# Altium schematic sheet Artix7_Power_1.SchDoc
size A3; SheetNumber: 4; SheetTotal: 14
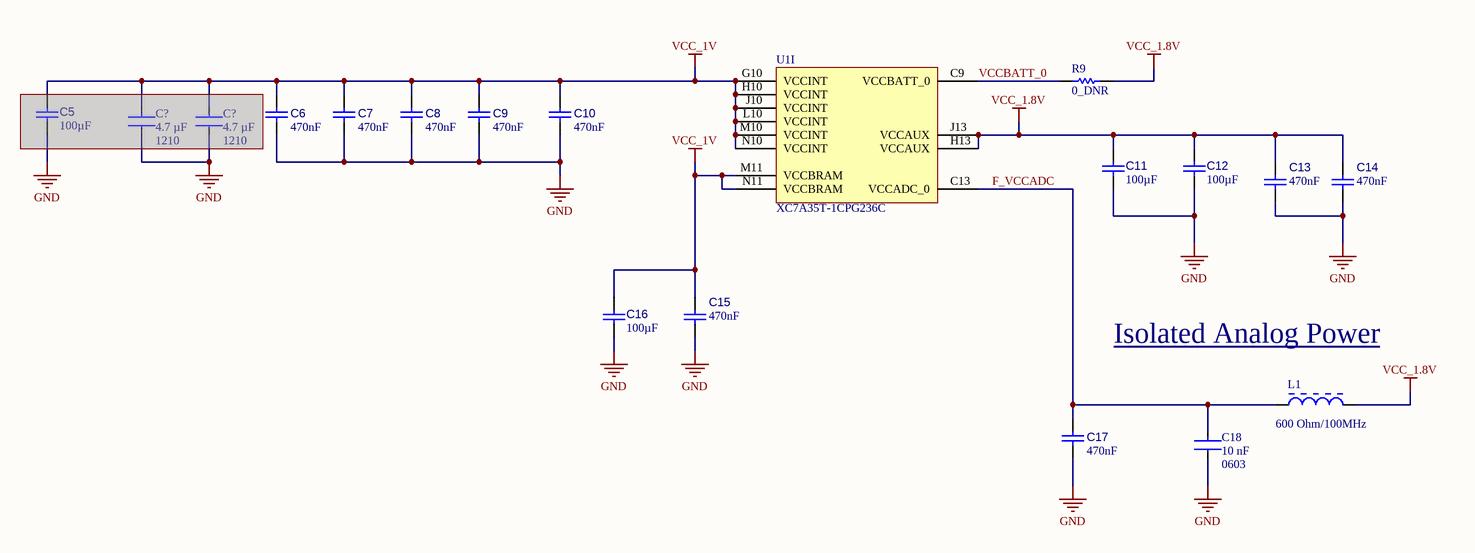
[diagram p0: Artix7_Power_1.SchDoc]

## Parts
(Parts that share a designator on the sheet are numbered #1, #2 ... from top to bottom, then left to right.)
C5  value 100µF  [CAPC0805(2012)145_L]  (hidden comment: Capacitor 100µF +/-20% 6.3V 0805)  (masked out: inside a compile mask, not in the netlist)
C6  value 470nF  [CAPC0402(1005)60_L]  (hidden comment: Capacitor 470nF +/-40% 10V 0402)
C7  value 470nF  [CAPC0402(1005)60_L]  (hidden comment: Capacitor 470nF +/-40% 10V 0402)
C8  value 470nF  [CAPC0402(1005)60_L]  (hidden comment: Capacitor 470nF +/-40% 10V 0402)
C9  value 470nF  [CAPC0402(1005)60_L]  (hidden comment: Capacitor 470nF +/-40% 10V 0402)
C10  value 470nF  [CAPC0402(1005)60_L]  (hidden comment: Capacitor 470nF +/-40% 10V 0402)
C11  value 100µF  [CAPC0805(2012)145_L]  (hidden comment: Capacitor 100µF +/-20% 6.3V 0805)
C12  value 100µF  [CAPC0805(2012)145_L]  (hidden comment: Capacitor 100µF +/-20% 6.3V 0805)
C13  value 470nF  [CAPC0402(1005)60_L]  (hidden comment: Capacitor 470nF +/-40% 10V 0402)
C14  value 470nF  [CAPC0402(1005)60_L]  (hidden comment: Capacitor 470nF +/-40% 10V 0402)
C15  value 470nF  [CAPC0402(1005)60_L]  (hidden comment: Capacitor 470nF +/-40% 10V 0402)
C16  value 100µF  [CAPC0805(2012)145_L]  (hidden comment: Capacitor 100µF +/-20% 6.3V 0805)
C17  value 470nF  [CAPC0402(1005)60_L]  (hidden comment: Capacitor 470nF +/-40% 10V 0402)
C18  Case Code (Imperial): 0603  Capacitance: 10 nF  [FP-0603-L_1_6_0_1-W_0_8_0-MFG]  (hidden comment: EMK107SD103KA-T)
C?#1  Case/Package: 1210  Capacitance: 4.7 µF  [FP-1210-L_3_3_0_4-W_2_5_0-IPC_B]  (hidden comment: 12105C475K4Z2A)  (masked out: inside a compile mask, not in the netlist)
C?#2  Case/Package: 1210  Capacitance: 4.7 µF  [FP-1210-L_3_3_0_4-W_2_5_0-IPC_B]  (hidden comment: 12105C475K4Z2A)  (masked out: inside a compile mask, not in the netlist)
L1  OhmAtFreq: 600 Ohm/100MHz  [BOUR-SRN3015-2_V]  (hidden comment: SRN3015-3R3M)
R9  value 0_DNR  [RESC0402(1005)_L]  (hidden comment: Resistor 10R  +/-1 % 0402 63 mW)
U1  XC7A35T-1CPG236C  [CPG236]  (part I of 10)

## Nets
GND: C6.2 C7.2 C8.2 C9.2 C10.2 C11.2 C12.2 C13.2 C14.1 C15.1 C16.2 C17.1 C18.2
VCC_1.8V: C11.1 C12.1 C13.1 C14.2 L1.1 R9.2 U1.H13(VCCAUX) U1.J13(VCCAUX)
VCC_1V: C6.1 C7.1 C8.1 C9.1 C10.1 C15.2 C16.1 U1.G10(VCCINT) U1.H10(VCCINT) U1.J10(VCCINT) U1.L10(VCCINT) U1.M10(VCCINT) U1.M11(VCCBRAM) U1.N10(VCCINT) U1.N11(VCCBRAM)
F_VCCADC: C17.2 C18.1 L1.2 U1.C13(VCCADC_0)
VCCBATT_0: R9.1 U1.C9(VCCBATT_0)

## Notes on the sheet
- Isolated Analog Power

## Library data of the parts
C5 C11 C12 C16 = CMP-001-00054-5: Chip Capacitor, 100µF +/-20%, 6.3V, 0805, Thickness 1.45 mm; Tolerance: 10%; Voltage Rating: 6.3V; Min Operating Temperature: -55°C; Case/Package: 0805; Max Operating Temperature: 85°C; Mounting Technology: SMT; Pins: 2
C6-C10 C13-C15 C17 = CMP-001-00060-5: Chip Capacitor, 470nF +/-40%, 10V, 0402, Thickness 0.6 mm; Tolerance: 20%; Max Operating Temperature: 85°C; Min Operating Temperature: -55°C; Case/Package: 0402; Voltage Rating: 10V; Mounting Technology: SMT; Pins: 2
C18 = CMP-14477-001835-2: None; Voltage Rating (DC): 16V; Tolerance: 10%; Mount: Surface Mount; Lead Free: Lead Free; Min Operating Temperature: -55°C; Resistor Type: Ceramic; Voltage Rating: 16V; Package Quantity: 1; RoHS Compliant: Yes; Case/Package: 0603; Length: 1.6mm; Radiation Hardening: No; Halogen Free: Halogen Free; Max Operating Temperature: 125°C; Thickness: 0.035inch; Termination: SMD/SMT; Case Code (Metric): 1608; Packaging: Tape and Reel; Weight: 7.1E-05oz; Width: 0.031inch; Construction: Flat; Height: 0.8mm; Depth: 0.8mm; Series: CFCAP™
C?#1 C?#2 = CMP-04427-013061-1: Automotive Ceramic Capacitor, 1210, 4.7uF, 10%, X7R, 15%, 50V; Dissipation Factor: 2.5%; Length: 3.2mm; Termination: SMD/SMT; Height: 2.79mm; Package Quantity: 1; Tolerance: 10%; Lead Free: Lead Free; Max Operating Temperature: 125°C; Number of Pins: 2; Voltage Rating (DC): 50V; Depth: 2.5mm; REACH SVHC: No SVHC; Series: FLEXITERM®; Construction: Flat; RoHS Compliant: Yes; Thickness: 0.11inch; Dielectric: X7R; Width: 0.098inch; Mount: Surface Mount; Packaging: Tape and Reel; Features: Soft Termination; Case Code (Metric): 3225; Voltage Rating: 50V; Case Code (Imperial): 1210; Min Operating Temperature: -55°C; Contact Plating: Tin; Ratings: AEC-Q200; Radiation Hardening: No
L1 = CMP-0007-00001-1: Semi-shielded Power Inductor, 3.3 uH, +/- 20%, 1.6 A, -40 to 125 degC, 3 x 3 x 1.5 mm SMD, RoHS and Halogen Free, Tape and Reel; Manufacturer: Bourns; DCR Max: 0.112 Ohm; Resistance to Solder Heat: +260 degC for 10 sec.; Inductance: 3.3 uH; Rated current: 1.6 A; SRF Min: 75 MHz; Isat: 1.4 A; Inductance tolerance: +/- 20%; PackageDescription: 2-Pin SMD, Body 3 x 3 mm, Height 1.5 mm; ComponentLink1URL: http://www.bourns.com/; ComponentLink3URL: http://www.bourns.com/data/global/pdfs/SRN3015.pdf; RoHS: TRUE; ComponentLink2URL: http://www.bourns.com/data/global/pdfs/SRN3015.pdf; DatasheetVersion: Aug-11; ComponentLink3Description: Package Specification; PartNumber: SRN3015-3R3M; ComponentLink2Description: Datasheet; Packing: Tape and Reel; ComponentLink1Description: Manufacturer URL; Mounting Technology: Surface Mount; PackageReference: SRN3015; Operating Temperature: -40 to 125 degC
R9 = CMP-009-00152-4: Chip Resistor, 10 Ohms, +/-1 %, 63 mW, -55 to 155 degC, 0402; Power: 63mW; Tolerance: 1%; Pins: 2; Case/Package: 0402; Max Operating Temperature: 155°C; Min Operating Temperature: -55°C
U1 = CMP-0383-00006-1: Artix-7 FPGA, 106 User I/Os, 2 GTP, 238-Ball BGA, Speed Grade 1, Commercial Grade, Pb-Free; Manufacturer: Xilinx; CMTs: 5; Total Block RAM: 1800 Kb; Logic Cells: 33280; Speed Grades: 1; GTP: 2; Available User I/O: 106; ComponentLink1URL: http://www.xilinx.com/; Maximum Distributed RAM: 400 Kb; PackageVersion: Rev. 1.11; PartNumber: XC7A35T-1CPG236C; ComponentLink2URL: http://www.xilinx.com/support/documentation/data_sheets/ds180_7Series_Overview.pdf; DatasheetVersion: Rev. 1.15; ComponentLink1Description: Manufacturer URL; ComponentLink3Description: Pinout; ComponentLink4Description: Package Specification; Mounting Technology: Surface Mount; PackageReference: CPG-236; Operating Temperature Range: Commercial; PackageDescription: 238-Ball Wire-Bond Chip-Scale BGA, Body 10 x10 mm, Pitch 0.5 mm; ComponentLink3URL: http://www.xilinx.com/support/documentation/user_guides/ug475_7Series_Pkg_Pinout.pdf; ComponentLink4URL: http://www.xilinx.com/support/documentation/user_guides/ug475_7Series_Pkg_Pinout.pdf; ComponentLink2Description: Datasheet